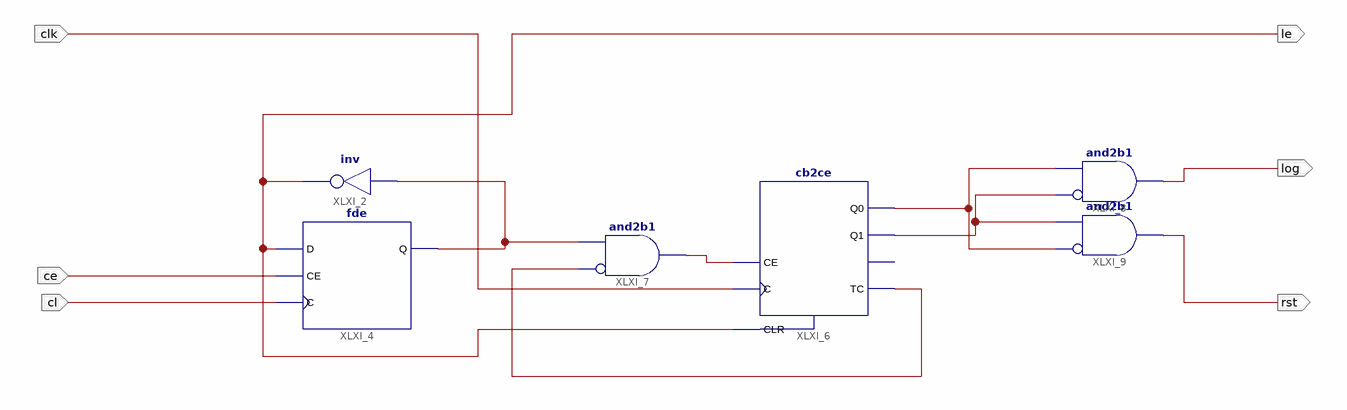
[diagram p0: schematic sheet 1]
// Xilinx ISE schematic counter10.sch (spartan3e) as structural Verilog: 6 symbols, 6 ports
module counter10 (
  input  clk,
  input  cl,
  input  ce,
  output log,
  output rst,
  output le
);

  wire XLXN_14, XLXN_15, XLXN_18, XLXN_19, XLXN_22;

  not XLXI_2 (le, XLXN_22);
  fde XLXI_4 (.C(cl), .CE(ce), .D(le), .Q(XLXN_22));
  cb2ce XLXI_6 (.C(clk), .CE(XLXN_14), .CLR(le), .Q0(XLXN_19), .Q1(XLXN_18), .TC(XLXN_15));  // open: CEO
  and XLXI_7 (XLXN_14, ~XLXN_15, XLXN_22);  // and2b1
  and XLXI_8 (log, ~XLXN_18, XLXN_19);  // and2b1
  and XLXI_9 (rst, ~XLXN_19, XLXN_18);  // and2b1
endmodule
